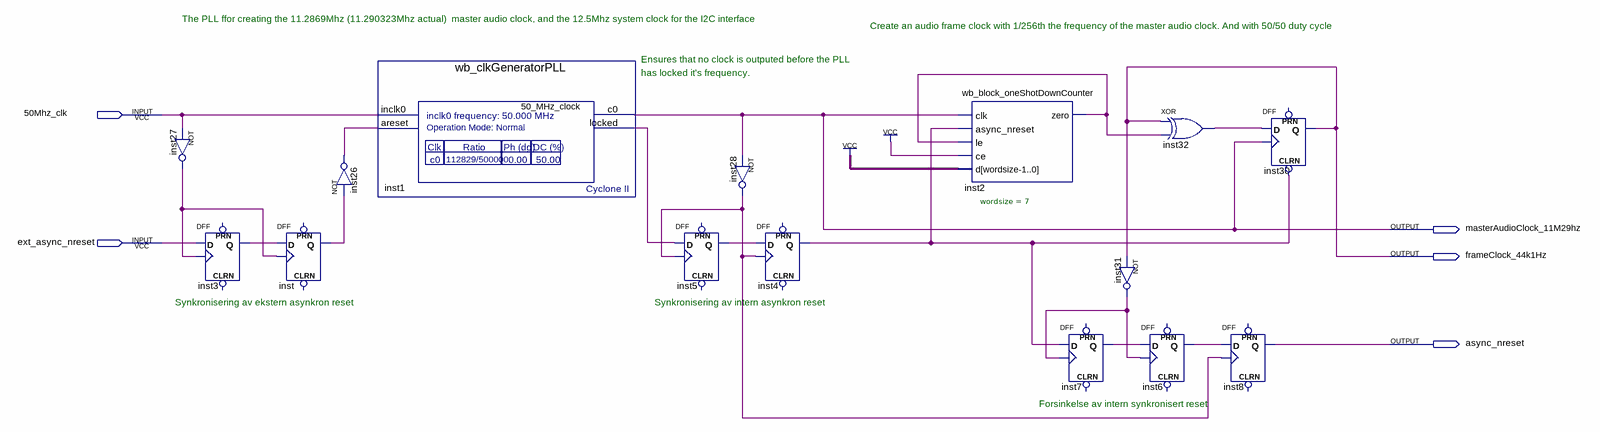
[diagram p0: schematic sheet]
// Quartus schematic wb_clkGenerator.bdf as structural Verilog: 15 symbols, 5 pins
module wb_clkGenerator (
  input  \50Mhz_clk ,
  input  ext_async_nreset,
  output masterAudioClock_11M29hz,
  output frameClock_44k1Hz,
  output async_nreset
);

  wire inst1_locked, inst2_zero, inst3_q, inst4_q, inst5_q, inst6_q, inst7_q, inst26_out, inst27_out,
       inst28_out, inst31_out, inst32_out, inst_q;

  not inst27 (inst27_out, \50Mhz_clk );
  DFF inst3 (.CLK(inst27_out), .D(ext_async_nreset), .Q(inst3_q));  // open: CLRN, PRN
  DFF inst (.CLK(inst27_out), .D(inst3_q), .Q(inst_q));  // open: CLRN, PRN
  not inst26 (inst26_out, inst_q);
  wb_clkGeneratorPLL inst1 (
    .inclk0(\50Mhz_clk ), .areset(inst26_out), .c0(masterAudioClock_11M29hz), .locked(inst1_locked));
  DFF inst5 (.CLK(inst28_out), .D(inst1_locked), .Q(inst5_q));  // open: CLRN, PRN
  not inst28 (inst28_out, masterAudioClock_11M29hz);
  DFF inst4 (.CLK(inst28_out), .D(inst5_q), .Q(inst4_q));  // open: CLRN, PRN
  wb_block_oneShotDownCounter #(.wordsize(7)) inst2 (
    .clk(masterAudioClock_11M29hz), .async_nreset(inst4_q), .le(inst2_zero), .ce(1'b1), .d({7{1'b1}}),
    .zero(inst2_zero));
  DFF inst7 (.CLK(inst31_out), .D(inst4_q), .Q(inst7_q));  // open: CLRN, PRN
  xor inst32 (inst32_out, frameClock_44k1Hz, inst2_zero);
  not inst31 (inst31_out, frameClock_44k1Hz);
  DFF inst6 (.CLK(inst31_out), .D(inst7_q), .Q(inst6_q));  // open: CLRN, PRN
  DFF inst30 (.CLRN(inst4_q), .CLK(masterAudioClock_11M29hz), .D(inst32_out), .Q(frameClock_44k1Hz));  // open: PRN
  DFF inst8 (.CLK(inst28_out), .D(inst6_q), .Q(async_nreset));  // open: CLRN, PRN

  // Other names for the same wires on the sheet: 50_MHz_clock = \50Mhz_clk 

  // Notes on the sheet:
  //   The PLL ffor creating the 11.2869Mhz (11.290323Mhz actual)  master audio clock, and the 12.5Mhz system clock for the I2C interface
  //   Create an audio frame clock with 1/256th the frequency of the master audio clock. And with 50/50 duty cycle
  //   Ensures that no clock is outputed before the PLL
  //   has locked it's frequency.
  //   Synkronisering av ekstern asynkron reset
  //   Synkronisering av intern asynkron reset
  //   Forsinkelse av intern synkronisert reset
endmodule
